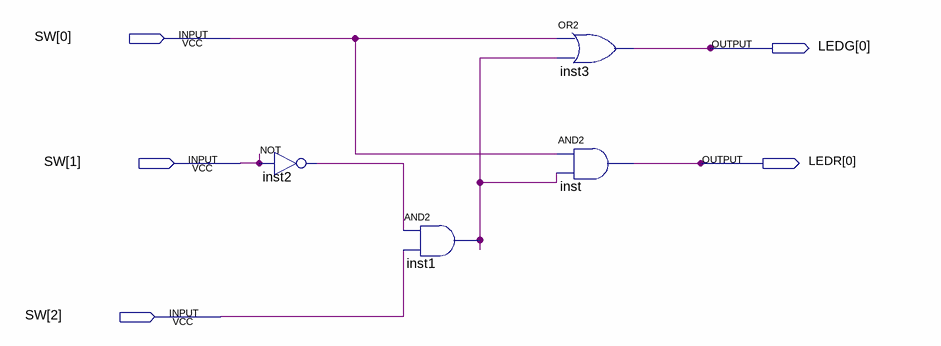
[diagram p0: schematic sheet]
// Quartus schematic Lab2.bdf as structural Verilog: 4 symbols, 5 pins
module Lab2 (
  input  [2:0] SW,
  output [0:0] LEDG,
  output [0:0] LEDR
);

  wire inst1_out, inst2_out;

  not inst2 (inst2_out, SW[1]);
  and inst1 (inst1_out, inst2_out, SW[2]);
  or inst3 (LEDG[0], SW[0], inst1_out);
  and inst (LEDR[0], SW[0], inst1_out);
endmodule
